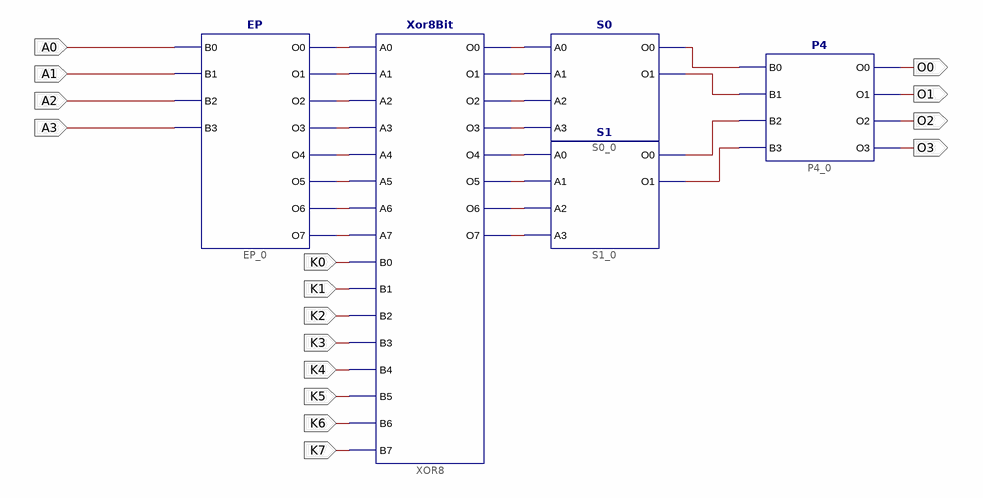
[diagram p0: schematic sheet 1]
// Xilinx ISE schematic F_Function.sch (xc9500xl) as structural Verilog: 5 symbols, 16 ports
module F_Function (
  input  A0,
  input  A1,
  input  A2,
  input  A3,
  input  K0,
  input  K1,
  input  K2,
  input  K3,
  input  K4,
  input  K5,
  input  K6,
  input  K7,
  output O0,
  output O1,
  output O2,
  output O3
);

  wire XLXN_21, XLXN_22, XLXN_23, XLXN_24, XLXN_25, XLXN_26, XLXN_27, XLXN_28, XLXN_30, XLXN_31, XLXN_32,
       XLXN_33, XLXN_34, XLXN_35, XLXN_36, XLXN_37, XLXN_38, XLXN_39, XLXN_40, XLXN_41;

  EP EP_0 (
    .B0(A0), .B1(A1), .B2(A2), .B3(A3), .O0(XLXN_21), .O1(XLXN_22), .O2(XLXN_23), .O3(XLXN_24), .O4(XLXN_25),
    .O5(XLXN_26), .O6(XLXN_27), .O7(XLXN_28));
  Xor8Bit XOR8 (
    .A0(XLXN_21), .A1(XLXN_22), .A2(XLXN_23), .A3(XLXN_24), .A4(XLXN_25), .A5(XLXN_26), .A6(XLXN_27),
    .A7(XLXN_28), .B0(K0), .B1(K1), .B2(K2), .B3(K3), .B4(K4), .B5(K5), .B6(K6), .B7(K7), .O0(XLXN_34),
    .O1(XLXN_35), .O2(XLXN_36), .O3(XLXN_37), .O4(XLXN_30), .O5(XLXN_31), .O6(XLXN_32), .O7(XLXN_33));
  S1 S1_0 (.A0(XLXN_30), .A1(XLXN_31), .A2(XLXN_32), .A3(XLXN_33), .O0(XLXN_40), .O1(XLXN_41));
  S0 S0_0 (.A0(XLXN_34), .A1(XLXN_35), .A2(XLXN_36), .A3(XLXN_37), .O0(XLXN_38), .O1(XLXN_39));
  P4 P4_0 (.B0(XLXN_38), .B1(XLXN_39), .B2(XLXN_40), .B3(XLXN_41), .O0(O0), .O1(O1), .O2(O2), .O3(O3));
endmodule
